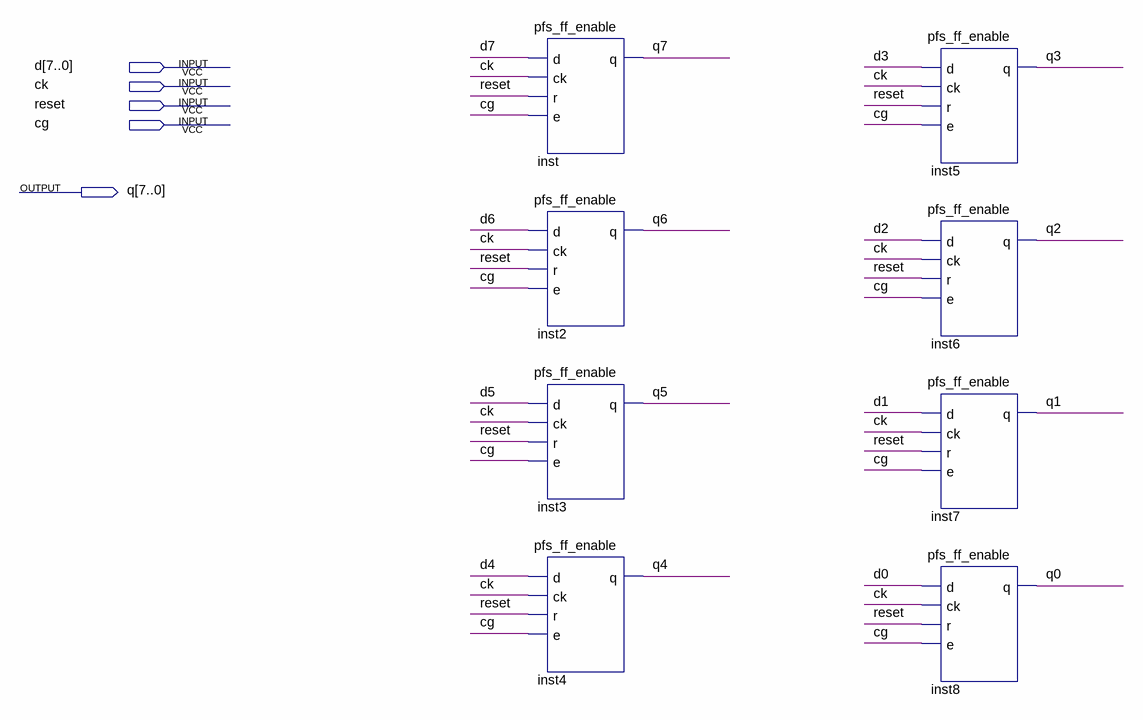
[diagram p0: schematic sheet]
// Quartus schematic pfs_8bit_reg.bdf as structural Verilog: 8 symbols, 5 pins
module pfs_8bit_reg (
  input  [7:0] d,
  input  ck,
  input  reset,
  input  cg,
  output [7:0] q
);

  pfs_ff_enable inst (.d(d[7]), .ck(ck), .r(reset), .e(cg), .q(q[7]));
  pfs_ff_enable inst2 (.d(d[6]), .ck(ck), .r(reset), .e(cg), .q(q[6]));
  pfs_ff_enable inst3 (.d(d[5]), .ck(ck), .r(reset), .e(cg), .q(q[5]));
  pfs_ff_enable inst4 (.d(d[4]), .ck(ck), .r(reset), .e(cg), .q(q[4]));
  pfs_ff_enable inst5 (.d(d[3]), .ck(ck), .r(reset), .e(cg), .q(q[3]));
  pfs_ff_enable inst6 (.d(d[2]), .ck(ck), .r(reset), .e(cg), .q(q[2]));
  pfs_ff_enable inst7 (.d(d[1]), .ck(ck), .r(reset), .e(cg), .q(q[1]));
  pfs_ff_enable inst8 (.d(d[0]), .ck(ck), .r(reset), .e(cg), .q(q[0]));
endmodule
